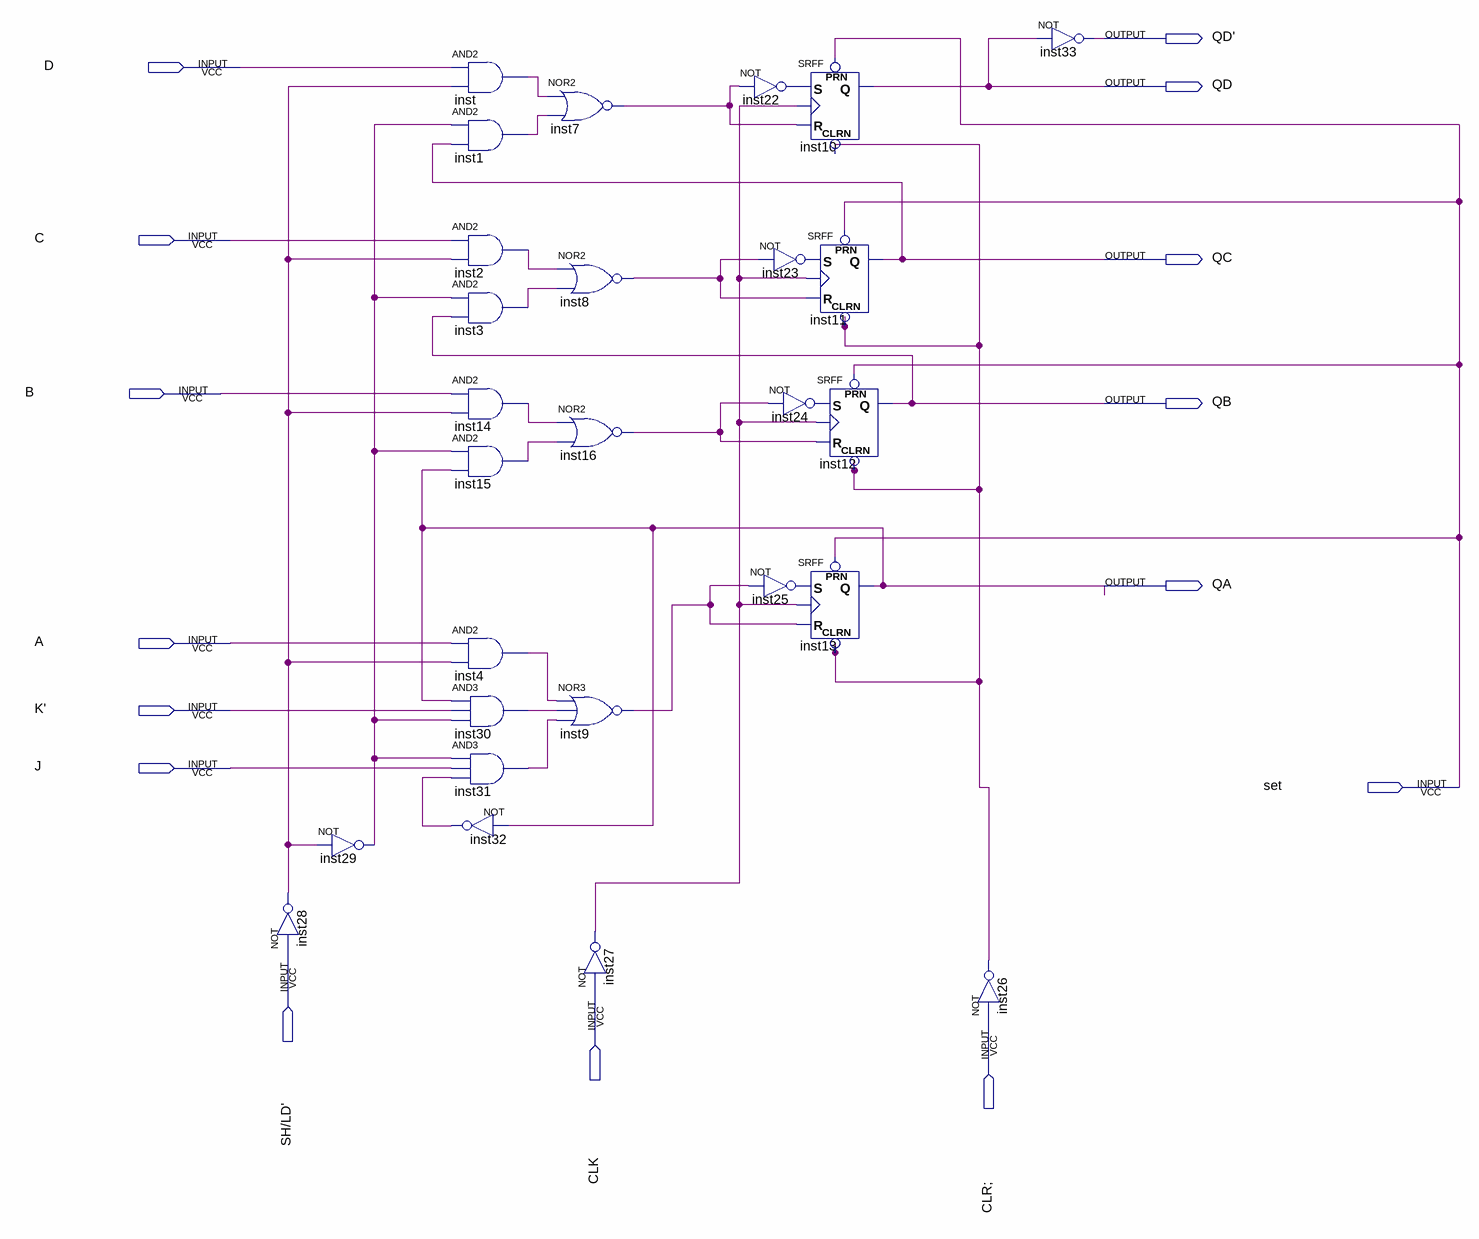
[diagram p0: schematic sheet]
// Quartus schematic kataxoritis.bdf as structural Verilog: 27 symbols, 15 pins
module kataxoritis (
  input  D,
  input  C,
  input  B,
  input  A,
  input  \K' ,
  input  J,
  input  set,
  input  \SH/LD' ,
  input  CLK,
  input  \CLR; ,
  output \QD' ,
  output QD,
  output QC,
  output QB,
  output QA
);

  wire inst1_out, inst2_out, inst3_out, inst4_out, inst7_out, inst8_out, inst9_out, inst14_out, inst15_out,
       inst16_out, inst22_out, inst23_out, inst24_out, inst25_out, inst26_out, inst27_out, inst28_out,
       inst29_out, inst30_out, inst31_out, inst32_out, inst_out;

  not inst29 (inst29_out, inst28_out);
  not inst28 (inst28_out, \SH/LD' );
  and inst (inst_out, D, inst28_out);
  and inst1 (inst1_out, inst29_out, QC);
  and inst2 (inst2_out, C, inst28_out);
  and inst3 (inst3_out, inst29_out, QB);
  and inst14 (inst14_out, B, inst28_out);
  and inst15 (inst15_out, inst29_out, QA);
  and inst4 (inst4_out, A, inst28_out);
  and inst30 (inst30_out, QA, \K' , inst29_out);
  and inst31 (inst31_out, inst29_out, J, inst32_out);
  not inst32 (inst32_out, QA);
  nor inst7 (inst7_out, inst_out, inst1_out);
  nor inst8 (inst8_out, inst2_out, inst3_out);
  nor inst16 (inst16_out, inst14_out, inst15_out);
  nor inst9 (inst9_out, inst4_out, inst30_out, inst31_out);
  not inst27 (inst27_out, CLK);
  not inst22 (inst22_out, inst7_out);
  not inst23 (inst23_out, inst8_out);
  not inst24 (inst24_out, inst16_out);
  not inst25 (inst25_out, inst9_out);
  SRFF inst10 (.PRN(set), .S(inst22_out), .R(inst7_out), .CLK(inst27_out), .Q(QD));  // open: CLRN
  SRFF inst11 (.PRN(set), .CLRN(inst26_out), .S(inst23_out), .R(inst8_out), .CLK(inst27_out), .Q(QC));
  SRFF inst12 (.PRN(set), .CLRN(inst26_out), .S(inst24_out), .R(inst16_out), .CLK(inst27_out), .Q(QB));
  SRFF inst13 (.PRN(set), .CLRN(inst26_out), .S(inst25_out), .R(inst9_out), .CLK(inst27_out), .Q(QA));
  not inst26 (inst26_out, \CLR; );
  not inst33 (\QD' , QD);
endmodule
